# EAGLE schematic rapidshark-display-butt-mk-1.2 (EAGLE 6.5.0)
AUTHOR: sean@yak.net
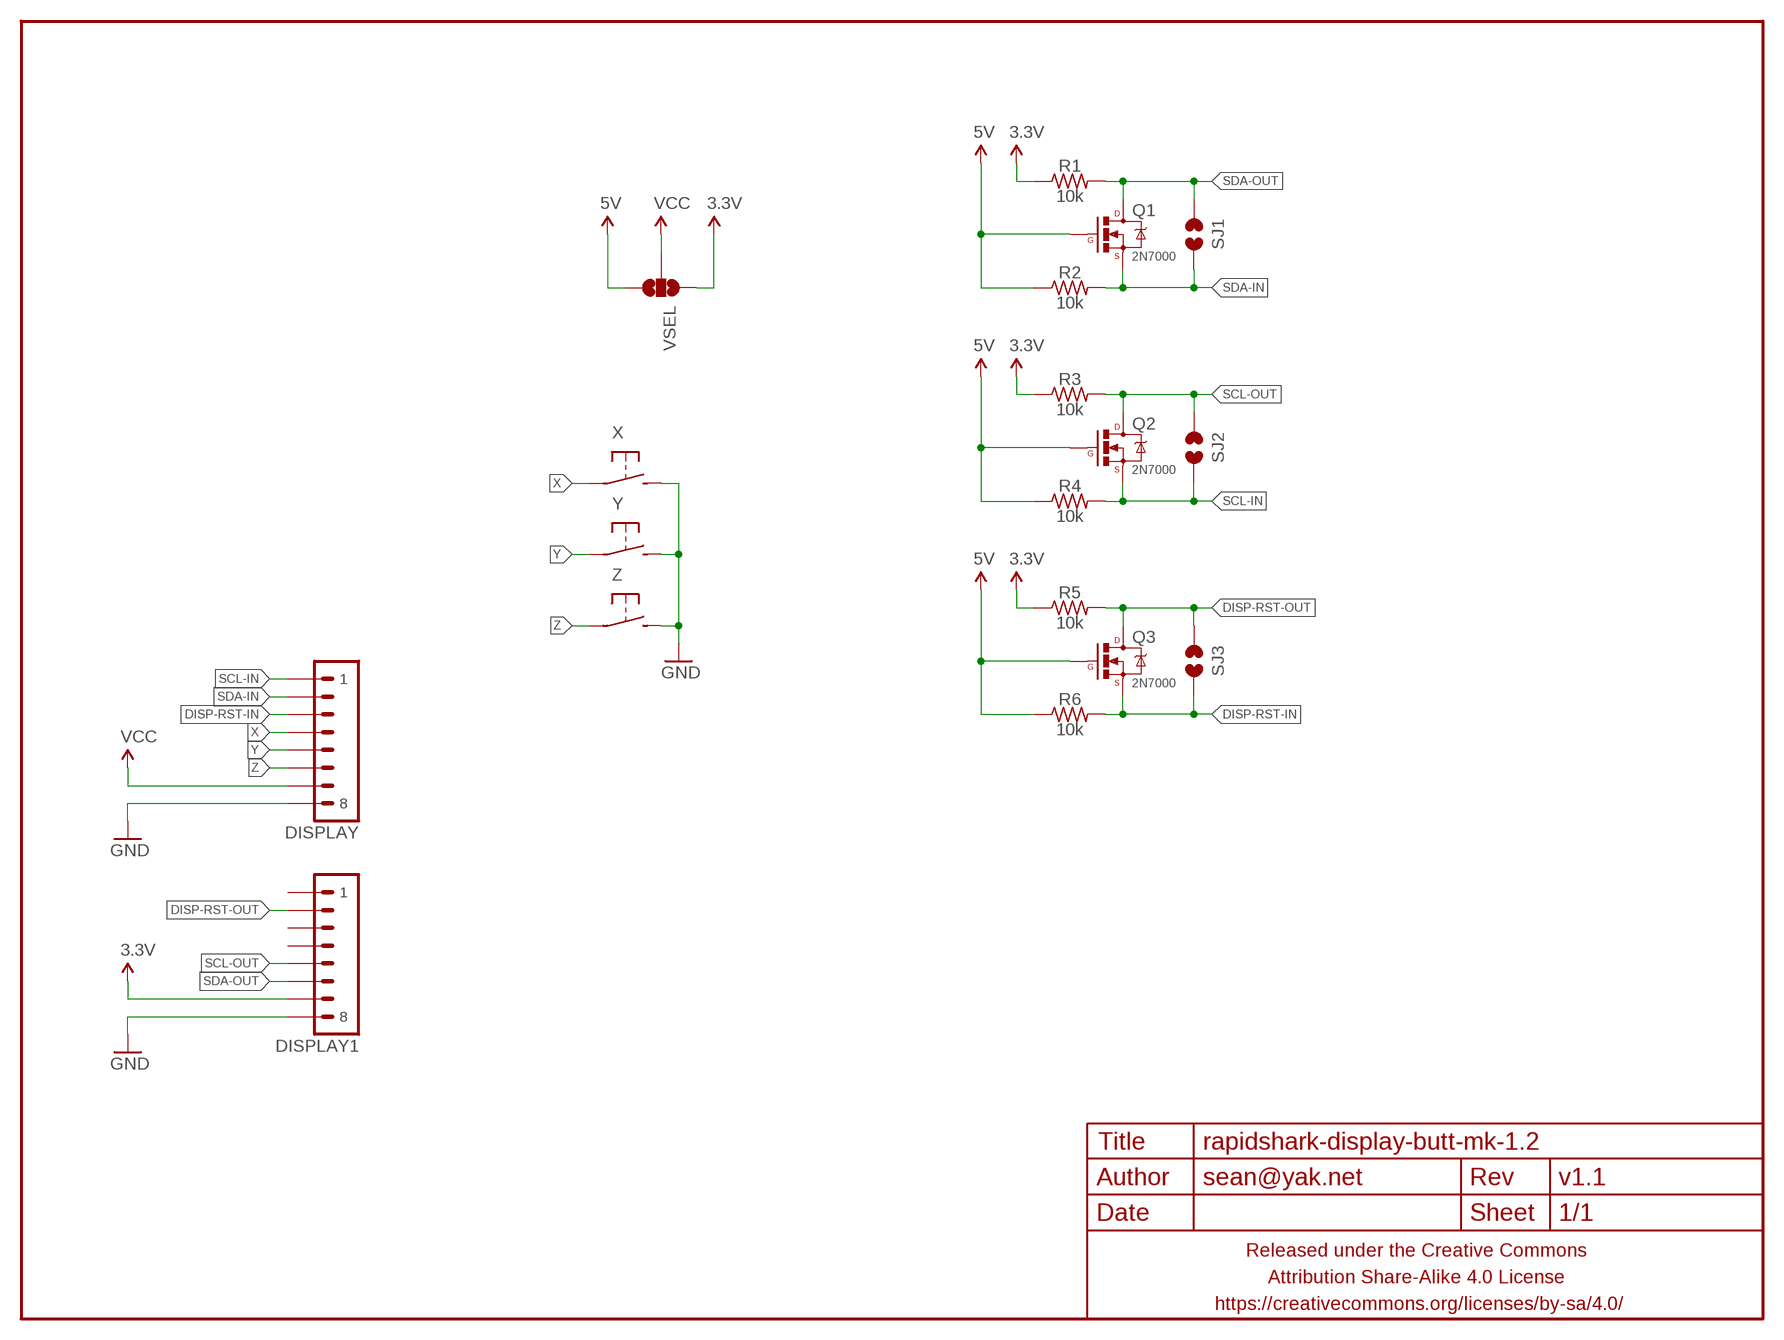
[diagram p0: schematic, sheet 1]

## Parts
DISPLAY  M08JST-PH-VERT-PTH  [JST-8-VERT-PTH]
DISPLAY1  M081X08  [1X08]
FRAME1  FRAME-LETTERNO_PACKAGE  [DUMMY]
Q1  2N7000  MOSFET-NCHANNEL2N7000-AMMO  [TO-92-AMMO]
Q2  2N7000  MOSFET-NCHANNEL2N7000-AMMO  [TO-92-AMMO]
Q3  2N7000  MOSFET-NCHANNEL2N7000-AMMO  [TO-92-AMMO]
R1  10k  RESISTORPTH-AXIAL-5.08MM  [RESISTOR-AXIAL-PTH-5.08MM]
R2  10k  RESISTORPTH-AXIAL-5.08MM  [RESISTOR-AXIAL-PTH-5.08MM]
R3  10k  RESISTORPTH-AXIAL-5.08MM  [RESISTOR-AXIAL-PTH-5.08MM]
R4  10k  RESISTORPTH-AXIAL-5.08MM  [RESISTOR-AXIAL-PTH-5.08MM]
R5  10k  RESISTORPTH-AXIAL-5.08MM  [RESISTOR-AXIAL-PTH-5.08MM]
R6  10k  RESISTORPTH-AXIAL-5.08MM  [RESISTOR-AXIAL-PTH-5.08MM]
SJ1  JUMPER-PAD-2-NOYES_SILK  [PAD-JUMPER-2-NO_YES_SILK]
SJ2  JUMPER-PAD-2-NOYES_SILK  [PAD-JUMPER-2-NO_YES_SILK]
SJ3  JUMPER-PAD-2-NOYES_SILK  [PAD-JUMPER-2-NO_YES_SILK]
VSEL  JUMPER-PAD-3-NOFULL_BOX_SILK  [PAD-JUMPER-3-NO_YES_SILK_FULL_BOX]
X  SPST-NO-TACT6MM-PTH-SMALL-PADS  [DTS-6-SMALL-PADS]
Y  SPST-NO-TACT6MM-PTH-SMALL-PADS  [DTS-6-SMALL-PADS]
Z  SPST-NO-TACT6MM-PTH-SMALL-PADS  [DTS-6-SMALL-PADS]

## Nets
3.3V: DISPLAY1.7 R1.P$1 R3.P$1 R5.P$1 VSEL.1
5V: Q1.2(G) Q2.2(G) Q3.2(G) R2.P$1 R4.P$1 R6.P$1 VSEL.3
DISP-RST-IN: DISPLAY.3 Q3.1(S) R6.P$2 SJ3.1
DISP-RST-OUT: DISPLAY1.2 Q3.3(D) R5.P$2 SJ3.2
GND: DISPLAY1.8 DISPLAY.8 X.3 X.4 Y.3 Y.4 Z.3 Z.4
SCL-IN: DISPLAY.1 Q2.1(S) R4.P$2 SJ2.1
SCL-OUT: DISPLAY1.5 Q2.3(D) R3.P$2 SJ2.2
SDA-IN: DISPLAY.2 Q1.1(S) R2.P$2 SJ1.1
SDA-OUT: DISPLAY1.6 Q1.3(D) R1.P$2 SJ1.2
VCC: DISPLAY.7 VSEL.2
X: DISPLAY.4 X.1 X.2
Y: DISPLAY.5 Y.1 Y.2
Z: DISPLAY.6 Z.1 Z.2
Unconnected: DISPLAY1.1 DISPLAY1.3 DISPLAY1.4

## Library data of the parts
DISPLAY DISPLAY1 = A_butts:M08: Header 8 Standard 8-pin 0.1" header. Use with straight break away headers (SKU : PRT-00116), right angle break away headers (PRT-00553), swiss pins (PRT-00743), machine pins (PRT-00117), and female headers (PRT-00115).
FRAME1 = A_butts:FRAME-LETTER: Schematic Frame Standard 8.5x11 US Letter frame; DESIGNER: sean@yak.net; VERSION: v1.1
Q1-Q3 = A_butts:MOSFET-NCHANNEL: Common NMOSFET Parts MFG P/N Store ID Prod ID FDD8780 TRANS-09984 SI7820DN TRANS-11055 FDS6630A IC-08089 2N7002PW TRANS-11151 FQP30N06L COM-10213 TRANS-10060 BSS123LT1G TRANS-08345 BSS138 TRANS-00830 BS170 2N7000
R1-R6 = A_butts:RESISTOR: RESISTOR, American symbol
SJ1-SJ3 = A_butts:JUMPER-PAD-2-NO
VSEL = A_butts:JUMPER-PAD-3-NO
X Y Z = A_butts:SPST-NO-TACT